# EAGLE design turtlebot (EAGLE 9.6.2)
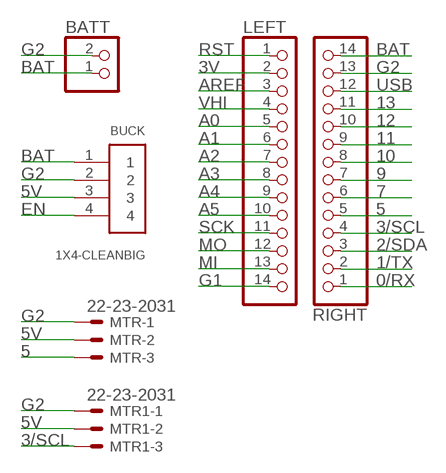
[diagram p0: schematic, sheet 1]

## Parts
BATT  JST_2PIN-THM-RA  [JST-PH-2-THM-RA]
BUCK  1X4-CLEANBIG  [1X04-CLEANBIG]
LEFT  MICROBUILDER_HEADER-1X14  [MICROBUILDER_1X14_ROUND70]
MTR  22-23-2031  [22-23-2031]
MTR1  22-23-2031  [22-23-2031]
RIGHT  MICROBUILDER_HEADER-1X14  [MICROBUILDER_1X14_ROUND70]

## Nets
0/RX: RIGHT.1
1/TX: RIGHT.2
2/SDA: RIGHT.3
3/SCL: MTR1.3 RIGHT.4
3V: LEFT.2
5: MTR.3 RIGHT.5
5V: BUCK.3 MTR1.2 MTR.2
7: RIGHT.6
9: RIGHT.7
10: RIGHT.8
11: RIGHT.9
12: RIGHT.10
13: RIGHT.11
A0: LEFT.5
A1: LEFT.6
A2: LEFT.7
A3: LEFT.8
A4: LEFT.9
A5: LEFT.10
AREF: LEFT.3
BAT: BATT.1 BUCK.1 RIGHT.14
EN: BUCK.4
G1: LEFT.14
G2: BATT.2 BUCK.2 MTR1.1 MTR.1 RIGHT.13
MI: LEFT.13
MO: LEFT.12
RST: LEFT.1
SCK: LEFT.11
USB: RIGHT.12
VHI: LEFT.4

## Library data of the parts
BATT = adafruit:JST_2PIN: JST 2-Pin Connectors of various flavors SMT-RA (S2B-PH-SM4) 4UConnector #17311 SMT (B2B-PH-SM4) THM-RA (S2B-PH) THM (B2B-PH)
BUCK = adafruit:1X4: 4-pin connector
LEFT RIGHT = Itsy Bitsy 32u4 3V:MICROBUILDER_HEADER-1X14
MTR MTR1 = con-molex:22-23-2031: .100" (2.54mm) Center Header - 3 Pin; MF: MOLEX; MPN: 22-23-2031; OC_FARNELL: 1462950; OC_NEWARK: 30C0862

## Board
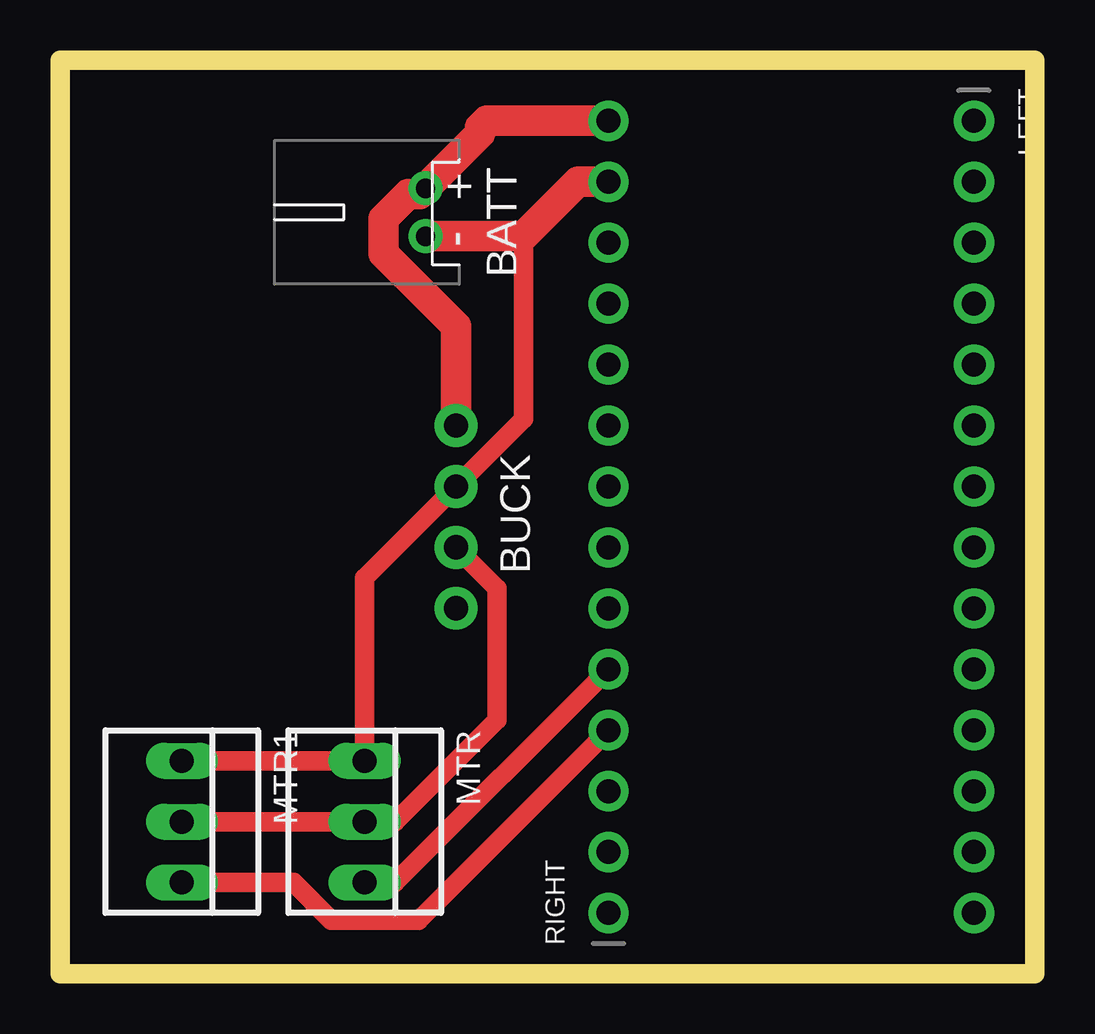
[diagram p1: board, top side]

Size 40.64 x 38.1 mm. Coordinates in mm from the lower left corner, seen from the top.
Outline: 0,38.1 0,0 40.64,0 40.64,38.1 0,38.1
Copper layers (1*16): Top 0.035mm / dielectric 1.5mm / Bottom 0.035mm
Design rules "default *": minimum track width 6mil, minimum drill 0.35mm, track to track 16mil, track to pad 16mil, pad to pad 16mil, via to via 16mil, smd to smd 6mil, copper to edge 40mil, drill to drill 6mil, minimum pad ring 10mil, minimum via ring 8mil, stop-mask expansion 4mil, vias tented up to drill 0mil, thermal gap 10mil

### Footprints (pad centres in the part's own frame; a part is rotated, then mirrored left to right if it is on the bottom)
JST-PH-2-THM-RA = drill 0.8 pad 1.422: 1 1,0; 2 -1,0
1X04-CLEANBIG = drill 1.016 pad 1.778: 1 -3.81,0; 2 -1.27,0; 3 1.27,0; 4 3.81,0
MICROBUILDER_1X14_ROUND70 = drill 1 pad 1.676: 1 -16.51,0; 2 -13.97,0; 3 -11.43,0; 4 -8.89,0; 5 -6.35,0; 6 -3.81,0; 7 -1.27,0; 8 1.27,0; 9 3.81,0; 10 6.35,0; 11 8.89,0; 12 11.43,0; 13 13.97,0; 14 16.51,0
22-23-2031 = drill 1 long: 1 -2.54,0; 2 0,0; 3 2.54,0

### Placement (x,y rotation side)
BATT  15.24,31.75 90 top
BUCK  16.51,19.05 270 top
LEFT  38.1,19.05 270 top
MTR  12.7,6.35 270 top
MTR1  5.08,6.35 270 top
RIGHT  22.86,19.05 90 top

### Tracks (layer width: path | path; a pad name or v marks a point on that pad's centre or on a via)
3/SCL
  Top 0.813: MTR1.3 9.73,3.81 11.3,2.24 14.94,2.24 RIGHT.4
5
  Top 0.813: MTR.3 13.97,3.81 RIGHT.5
5V
  Top 0.813: BUCK.3 18.21,16.08 18.21,10.59 13.97,6.35 MTR.2 MTR1.2
BAT
  Top 1.27: RIGHT.14 17.78,35.56 17.51,35.29 17.51,35.02 BATT.1 14.99,32.5 14.51,32.5 13.49,31.48 13.49,30.02 16.51,27 BUCK.1
G2
  Top 0.813: 19.32,30.75 19.32,23.13 BUCK.2 12.7,16.51 MTR.1 MTR1.1
  Top 1.27: BATT.2 19.32,30.75 21.59,33.02 RIGHT.13